# Altium schematic sheet UpstreamPort.SchDoc
size A4; DocumentNumber: 1; SheetNumber: 6; SheetTotal: 7
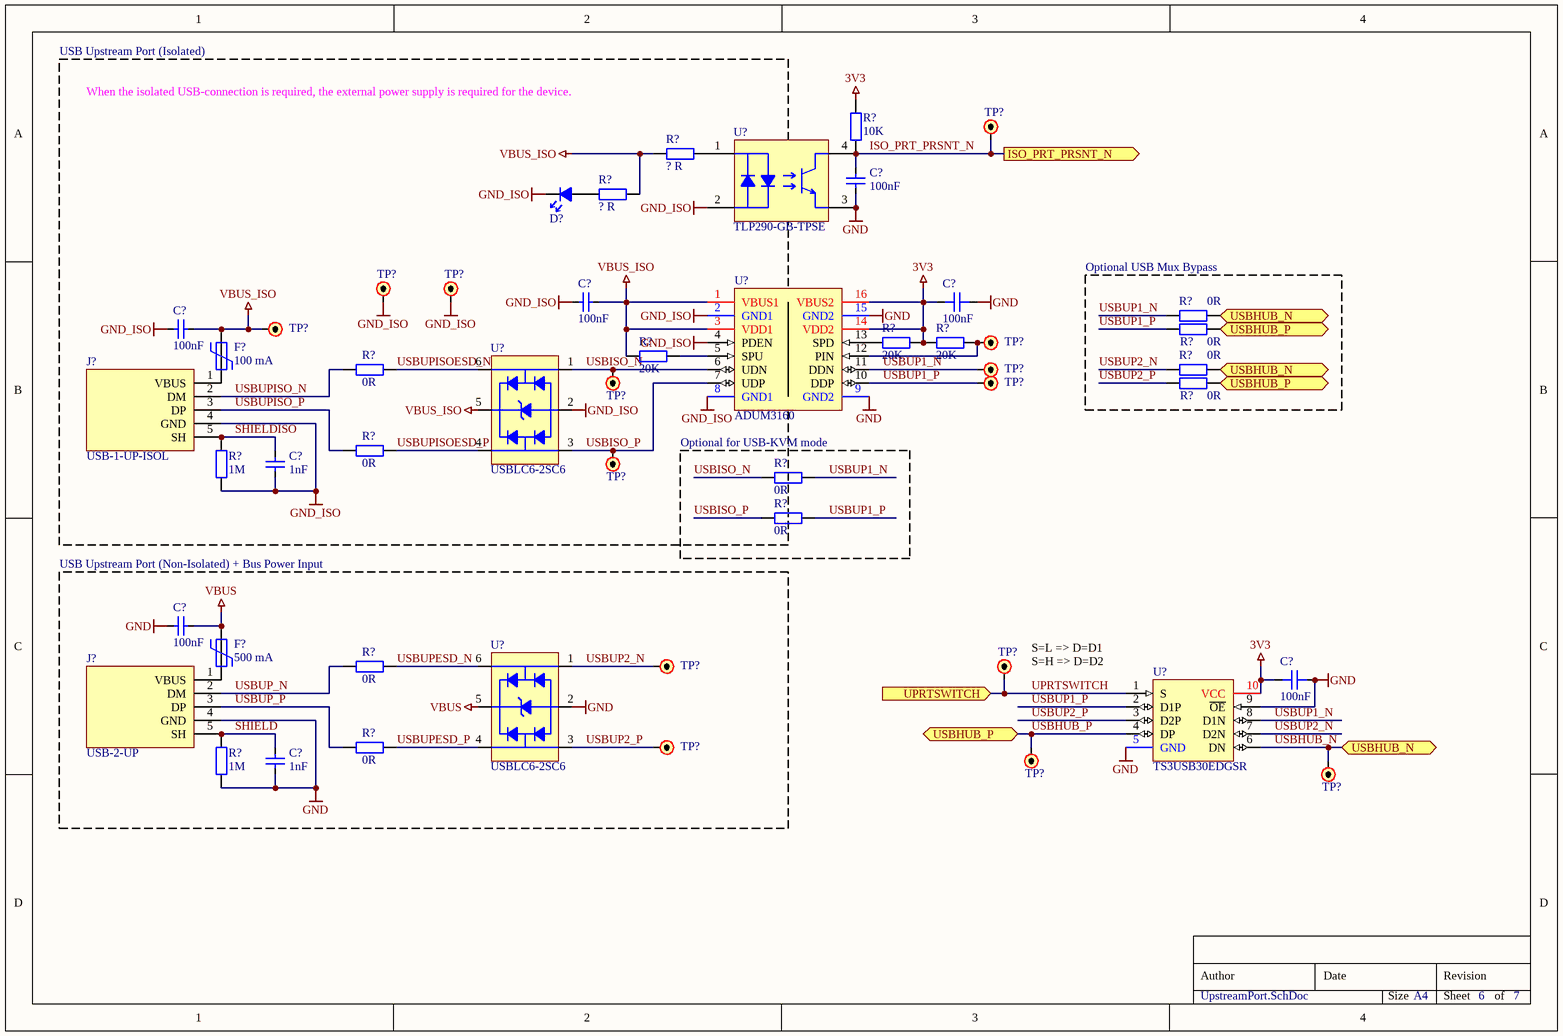
[diagram p0: UpstreamPort.SchDoc]

## Parts
(Parts that share a designator on the sheet are numbered #1, #2 ... from top to bottom, then left to right.)
C?#1  100nF  [0603C_RF_M]
C?#2  100nF  [1206C_RF_M]
C?#3  100nF  [1206C_RF_M]
C?#4  100nF  [1206C_RF_M]
C?#5  1nF  [0603C_RF_M]
C?#6  100nF  [1206C_RF_M]
C?#7  100nF  [1206C_RF_M]
C?#8  1nF  [0603C_RF_M]
D?  Unspecified  [0805LED_RF_M]  (value not drawn)
F?#1  100 mA  [BOURNS_MF-MSMF110/16-2_RF_H]
F?#2  500 mA  [BOURNS_MF-MSMF110/16-2_RF_H]
J?#1  USB-1-UP-ISOL  [UJ2-BH-2-TH]
J?#2  USB-2-UP  [UJ2-BH-2-TH]
R?#1  10K  [0603R_RF_M]
R?#2  ? R  [0603R_RF_M]
R?#3  ? R  [0603R_RF_M]
R?#4  0R  [0603R_RF_M]
R?#5  0R  [0603R_RF_M]
R?#6  20K  [0603R_RF_M]
R?#7  20K  [0603R_RF_M]
R?#8  20K  [0603R_RF_M]
R?#9  0R  [0603R_RF_M]
R?#10  0R  [0603R_RF_M]
R?#11  0R  [0603R_RF_M]
R?#12  0R  [0603R_RF_M]
R?#13  0R  [0603R_RF_M]
R?#14  1M  [0603R_RF_M]
R?#15  0R  [0603R_RF_M]
R?#16  0R  [0603R_RF_M]
R?#17  0R  [0603R_RF_M]
R?#18  1M  [0603R_RF_M]
TP?#1  Test Point  [PAD_R_1.5MM]  (value not drawn)
TP?#2  Test Point  [PAD_R_1.5MM]  (value not drawn)
TP?#3  Test Point  [PAD_R_1.5MM]  (value not drawn)
TP?#4  Test Point  [PAD_R_1.5MM]  (value not drawn)
TP?#5  Test Point  [PAD_R_1.5MM]  (value not drawn)
TP?#6  Test Point  [PAD_R_1.5MM]  (value not drawn)
TP?#7  Test Point  [PAD_R_1.5MM]  (value not drawn)
TP?#8  Test Point  [PAD_R_1.5MM]  (value not drawn)
TP?#9  Test Point  [PAD_R_1.5MM]  (value not drawn)
TP?#10  Test Point  [PAD_R_1.5MM]  (value not drawn)
TP?#11  Test Point  [PAD_R_1.5MM]  (value not drawn)
TP?#12  Test Point  [PAD_R_1.5MM]  (value not drawn)
TP?#13  Test Point  [PAD_R_1.5MM]  (value not drawn)
TP?#14  Test Point  [PAD_R_1.5MM]  (value not drawn)
U?#1  TLP290-GB-TPSE  [SO-4-SOIC127P600-8N]
U?#2  ADUM3160  [ADUM3160_SOP-16_RF_M]
U?#3  USBLC6-2SC6  [TI_SOT-23-6]
U?#4  TS3USB30EDGSR  [TI_VSSOP-10_RF_M]
U?#5  USBLC6-2SC6  [TI_SOT-23-6]

## Blocks framed on the sheet
USB Upstream Port (Isolated): C?#2 C?#4 C?#5 D? F?#1 J?#1 R?#2 R?#3 R?#8 R?#9 R?#12 R?#14 TP?#2-TP?#4 TP?#6 TP?#9 U?#1 U?#3
Optional USB Mux Bypass: R?#4 R?#5 R?#10 R?#11
Optional for USB-KVM mode: R?#13 R?#15
USB Upstream Port (Non-Isolated) + Bus Power Input: C?#6 C?#8 F?#2 J?#2 R?#16-R?#18 TP?#10 TP?#12 U?#5

## Ports
ISO_PRT_PRSNT_N (out), UPRTSWITCH (in), USBHUB_N (bidir), USBHUB_P (bidir)

## Nets
3V3: C?#3.1 C?#7.1 R?#1.1 R?#6.2 R?#7.1 U?#2.14(VDD2) U?#2.16(VBUS2) U?#4.10(VCC)
GND: C?#1.1 C?#3.2 C?#6.2 C?#7.2 C?#8.1 J?#2.4(GND) R?#18.1 U?#1.3 U?#2.9(GND2) U?#2.15(GND2) U?#4.5(GND) U?#4.9(~{OE}) U?#5.2
GND_ISO: C?#2.2 C?#4.2 C?#5.1 D?.C J?#1.4(GND) R?#14.1 TP?#2.1 TP?#3.1 U?#1.2 U?#2.2(GND1) U?#2.4(PDEN) U?#2.8(GND1) U?#3.2
VBUS: C?#6.1 F?#2.2 U?#5.5
VBUS_ISO: C?#2.1 C?#4.1 F?#1.2 R?#2.1 R?#3.1 R?#8.1 TP?#4.1 U?#2.1(VBUS1) U?#2.3(VDD1) U?#3.5
ISO_PRT_PRSNT_N: C?#1.2 R?#1.2 TP?#1.1 U?#1.4 ; port ISO_PRT_PRSNT_N
SHIELD: C?#8.2 J?#2.5(SH) R?#18.2
SHIELDISO: C?#5.2 J?#1.5(SH) R?#14.2
UPRTSWITCH: TP?#11.1 U?#4.1(S) ; port UPRTSWITCH
USBHUB_N: R?#4.2 R?#10.2 TP?#14.1 U?#4.6(DN) ; port USBHUB_N
USBHUB_P: R?#5.2 R?#11.2 TP?#13.1 U?#4.4(DP) ; port USBHUB_P
USBISO_N: R?#13.2 TP?#6.1 U?#2.6(UDN) U?#3.1
USBISO_P: R?#15.2 TP?#9.1 U?#2.7(UDP) U?#3.3
USBUP1_N: R?#4.1 R?#13.1 TP?#7.1 U?#2.11(DDN) U?#4.8(D1N)
USBUP1_P: R?#5.1 R?#15.1 TP?#8.1 U?#2.10(DDP) U?#4.2(D1P)
USBUP2_N: R?#10.1 TP?#10.1 U?#4.7(D2N) U?#5.1
USBUP2_P: R?#11.1 TP?#12.1 U?#4.3(D2P) U?#5.3
USBUP_N: J?#2.2(DM) R?#16.2
USBUP_P: J?#2.3(DP) R?#17.2
USBUPESD_N: R?#16.1 U?#5.6
USBUPESD_P: R?#17.1 U?#5.4
USBUPISO_N: J?#1.2(DM) R?#9.2
USBUPISO_P: J?#1.3(DP) R?#12.2
USBUPISOESD_N: R?#9.1 U?#3.6
USBUPISOESD_P: R?#12.1 U?#3.4
NetD?_A: D?.A R?#3.2
NetF?#1_1: F?#1.1 J?#1.1(VBUS)
NetF?#2_1: F?#2.1 J?#2.1(VBUS)
NetR?#2_2: R?#2.2 U?#1.1
NetR?#6_1: R?#6.1 U?#2.13(SPD)
NetR?#7_2: R?#7.2 TP?#5.1 U?#2.12(PIN)
NetR?#8_2: R?#8.2 U?#2.5(SPU)

## Notes on the sheet
- When the isolated USB-connection is required, the external power supply is required for the device.
- (near TP?#11) S=L => D=D1
  S=H => D=D2
- Author
- Date
- Revision
- Size
- A4
- Sheet
- of

## Library data of the parts
C?#1-C?#8 = C: Capacitor; Manufacturer: Generic Brand; Max Voltage: ? V; Tolerance: ?; Manufacturer Part No: *; Supplier: *; Supplier Link: http://; Supplier Part No: *; Category: Capacitor; Mounting Technology: SMT
  C?#1-C?#4 C?#6 C?#7: Value: 100nF
  C?#5 C?#8: Value: 1nF
D? = LED: Manufacturer: Generic Brand; Forward Voltage Drop: ? V; Emitting Color: Unspecified; Manufacturer Part No: *; Supplier: *; Supplier Link: http://; Supplier Part No: *; Category: Diode; Mounting Technology: SMT
F?#1 F?#2 = PPTC: Resettable Fuse; Manufacturer: Generic Brand; Max Voltage: ? V; Category: Fuse; Mounting Technology: SMT; Supplier Link: http://
  F?#1: Hold Current: 100 mA
  F?#2: Hold Current: 500 mA
J?#1 J?#2 = USBB-1J: USB Type B Receptacle; pin to pad: 5>SH; Manufacturer: Connfly; Product Number: USBB-1J (DS1099-WN0); Mounting Type: THT; Case: USB Type B; Supplier: Chipdip; Supplier Link: https://www.chipdip.by/product/usbb-1j; Supplier Part No: 249636968
R?#1-R?#8 R?#10 R?#11 R?#13 R?#15 = R: Resistor; Manufacturer: Generic Brand; Power Rating: ? W; Max Voltage: ? V; Tolerance: ?; Supplier Link: http://; Category: Resistor; Mounting Technology: SMT
  R?#1: Value: 10K
  R?#2 R?#3: Value: ? R
  R?#4 R?#5 R?#10 R?#11 R?#13 R?#15: Value: 0R
  R?#6-R?#8: Value: 20K
R?#9 R?#12 R?#14 R?#16-R?#18 = R: Resistor; Manufacturer: Generic Brand; Max Voltage: ? V; Power Rating: ? W; Tolerance: ?; Manufacturer Part No: *; Supplier: *; Supplier Link: http://; Supplier Part No: *; Category: Resistor; Mounting Technology: SMT
  R?#9 R?#12 R?#16 R?#17: Value: 0R
  R?#14 R?#18: Value: 1M
TP?#1-TP?#14 = Test Point: Test Point / Pad
U?#1 = TLP290-GB-TPSE: OPTOISOLATOR 3.75KV TRANS 4-SO; URL: https://www.digikey.co.uk/product-detail/en/toshiba-semiconductor-and-storage/TLP290-GB-TPSE/TLP290-GB-TPSECT-ND/4562941; MountingTechnology: SMT
U?#2 = ADUM3160: DGT ISOL 2500VRMS 2CH USB 16SOIC; Manufacturer: Analog Devices Inc.; Product Number: ADUM3160BRWZ-RL; Mounting Technology: SMT; Package: SOP-16; Supplier: DigiKey; Alternative Supplier: Belchip; Supplier Link: https://www.digikey.com/en/products/detail/analog-devices-inc/ADUM3160BRWZ-RL/2606661; Supplier Part No: ADUM3160BRWZ-RLCT-ND; Alternative Supplier Link: https://belchip.by/product/?selected_product=43702; Alternative Supplier Part No: 43702
U?#3 U?#5 = USBLC6-2SC6: Low Capacitance USB ESD Protection; Manufacturer: STMicroelectronics; Supplier Link: https://www.chipdip.by/product/usblc6-2sc6; Supplier Part No: 9000039051; Supplier: Chipdip; Case: SOT-23-6; Mounting Type: SMT; Product Name: USBLC6-2SC6
U?#4 = TS3USB30EDGSR: IC USB SWITCH SGL 1X2 10MSOP; Manufacturer: Texas Instruments; Supplier Link: https://www.digikey.com/en/products/detail/texas-instruments/TS3USB30EDGSR/2193086; Supplier: DigiKey; Supplier Part No: 296-25495-1-ND; Mounting Technology: SMT; Product Number: TS3USB30EDGSR; Category: IC; Package: MSOP-10